# Altium schematic sheet MPP.SchDoc
size A3
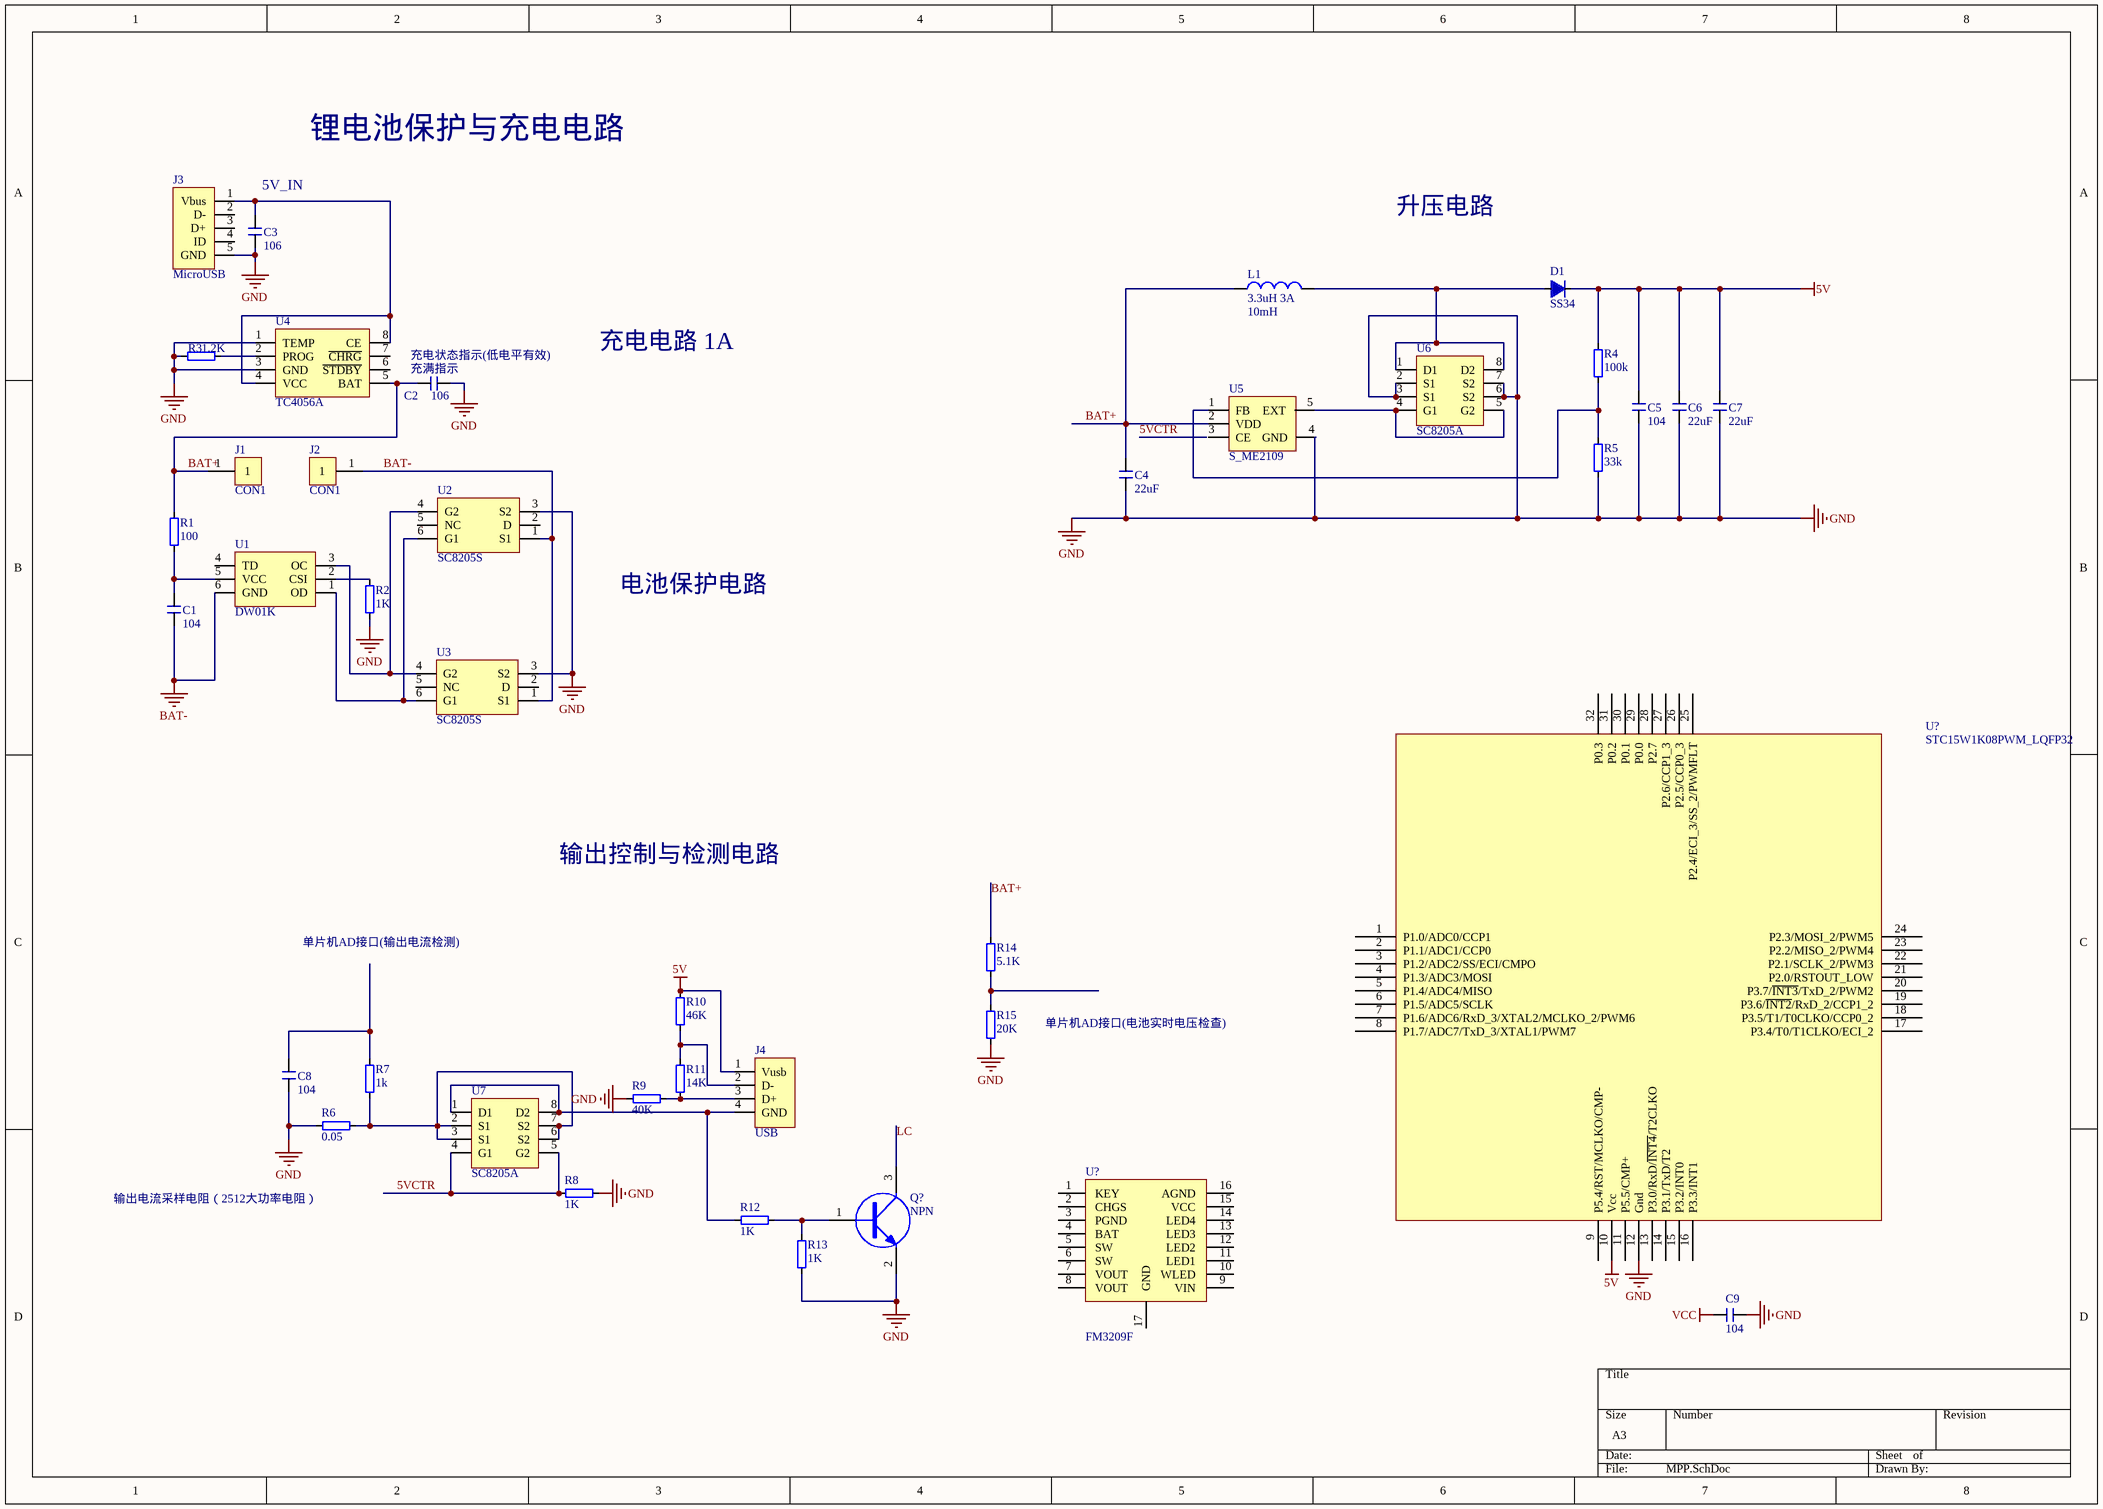
[diagram p0: MPP.SchDoc]

## Parts
(Parts that share a designator on the sheet are numbered #1, #2 ... from top to bottom, then left to right.)
C1  104
C2  106
C3  106
C4  22uF
C5  104
C6  22uF
C7  22uF
C8  104
C9  104
D1  SS34
J1  CON1
J2  CON1
J3  MicroUSB
J4  USB
L1  3.3uH 3A  value 10mH  [0402-A]
Q?  NPN
R1  100
R2  1K
R3  1.2K
R4  100k
R5  33k
R6  0.05
R7  1k
R8  1K
R9  40K
R10  46K
R11  14K
R12  1K
R13  1K
R14  5.1K
R15  20K
U1  DW01K
U2  SC8205S
U3  SC8205S
U4  TC4056A
U5  S_ME2109
U6  SC8205A
U7  SC8205A
U?#1  STC15W1K08PWM_LQFP32  [LQFP32]
U?#2  FM3209F

## Nets
5V: C5.2 C6.2 C7.2 D1.2 J4.1(Vusb) R4.2 R10.2 U?#1.10(Vcc)
BAT-: C1.1 J2.1 U1.6(GND) U2.1(S1) U3.1(S1)
GND: C2.1 C3.2 C4.1 C5.1 C6.1 C7.1 C8.1 C9.1 J3.5(GND) Q?.2(E) R2.1 R3.2 R5.1 R6.1 R8.2 R9.2 R13.1 R15.1 U2.3(S2) U3.3(S2) U4.1(TEMP) U4.3(GND) U5.4(GND) U6.2(S1) U6.3(S1) U6.6(S2) U6.7(S2) U?#1.12(Gnd)
VCC: C9.2
5VCTR: R8.1 U7.4(G1) U7.5(G2)
BAT+: C2.2 C4.2 J1.1 L1.1 R1.2 R14.2 U4.5(BAT) U5.2(VDD)
LC: Q?.3(C)
NetC1_2: C1.2 R1.1 U1.5(VCC)
NetC3_1: C3.1 J3.1(Vbus) U4.4(VCC) U4.8(CE)
NetC8_2: C8.2 R7.2
NetD1_1: D1.1 L1.2 U6.1(D1) U6.8(D2)
NetJ4_2: J4.2(D-) R10.1 R11.2
NetJ4_3: J4.3(D+) R9.1 R11.1
NetJ4_4: J4.4(GND) R12.1 U7.1(D1) U7.8(D2)
NetQ?_1: Q?.1(B) R12.2 R13.2
NetR2_2: R2.2 U1.2(CSI)
NetR3_1: R3.1 U4.2(PROG)
NetR4_1: R4.1 R5.2 U5.1(FB)
NetR6_2: R6.2 R7.1 U7.2(S1) U7.3(S1) U7.6(S2) U7.7(S2)
NetR14_1: R14.1 R15.2
NetU1_1: U1.1(OD) U2.6(G1) U3.6(G1)
NetU1_3: U1.3(OC) U2.4(G2) U3.4(G2)
NetU5_5: U5.5(EXT) U6.4(G1) U6.5(G2)

Not connected (* = marked no-connect by the designer): J3 2(D-) 3(D+) 4(ID); U1 4(TD); U2 2(D) 5(NC); U3 2(D) 5(NC); U4 6(~{STDBY}) 7(~{CHRG}); U5 3(CE); U?#1 1(P1.0/ADC0/CCP1) 2(P1.1/ADC1/CCP0) 3(P1.2/ADC2/SS/ECI/CMPO) 4(P1.3/ADC3/MOSI) 5(P1.4/ADC4/MISO) 6(P1.5/ADC5/SCLK) 7(P1.6/ADC6/RxD_3/XTAL2/MCLKO_2/PWM6) 8(P1.7/ADC7/TxD_3/XTAL1/PWM7) 9(P5.4/RST/MCLKO/CMP-) 11(P5.5/CMP+) 13(P3.0/RxD/~{INT4}/T2CLKO) 14(P3.1/TxD/T2) 15(P3.2/INT0) 16(P3.3/INT1) 17(P3.4/T0/T1CLKO/ECI_2) 18(P3.5/T1/T0CLKO/CCP0_2) 19(P3.6/~{INT2}/RxD_2/CCP1_2) 20(P3.7/~{INT3}/TxD_2/PWM2) 21(P2.0/RSTOUT_LOW) 22(P2.1/SCLK_2/PWM3) 23(P2.2/MISO_2/PWM4) 24(P2.3/MOSI_2/PWM5) 25(P2.4/ECI_3/SS_2/PWMFLT) 26(P2.5/CCP0_3) 27(P2.6/CCP1_3) 28(P2.7) 29(P0.0) 30(P0.1) 31(P0.2) 32(P0.3); U?#2 1(KEY) 2(CHGS) 3(PGND) 4(BAT) 5(SW) 6(SW) 7(VOUT) 8(VOUT) 9(VIN) 10(WLED) 11(LED1) 12(LED2) 13(LED3) 14(LED4) 15(VCC) 16(AGND) 17(GND)

## Notes on the sheet
- 锂电池保护与充电电路
- 5V_IN
- 升压电路
- (near C2) 充满指示
- (near C2) 充电状态指示(低电平有效)
- 充电电路 1A
- 电池保护电路
- 输出控制与检测电路
- 单片机AD接口(输出电流检测)
- 单片机AD接口(电池实时电压检查)
- 输出电流采样电阻（2512大功率电阻）

## Library data of the parts
C1-C9 = Cap
D1 = Diode
L1 = Inductor: Code_IEC: 1005; Published: 8-Jun-2000; LatestRevisionDate: 29-May-2009; LatestRevisionNote: IPC-7351 Footprint Added.; PackageReference: 0402-A; Publisher: Altium Limited; PackageDescription: Chip Inductor; Code_JEITA: 0402
R1-R15 = Resistor